# EAGLE schematic atmega2560test (EAGLE 6.1)
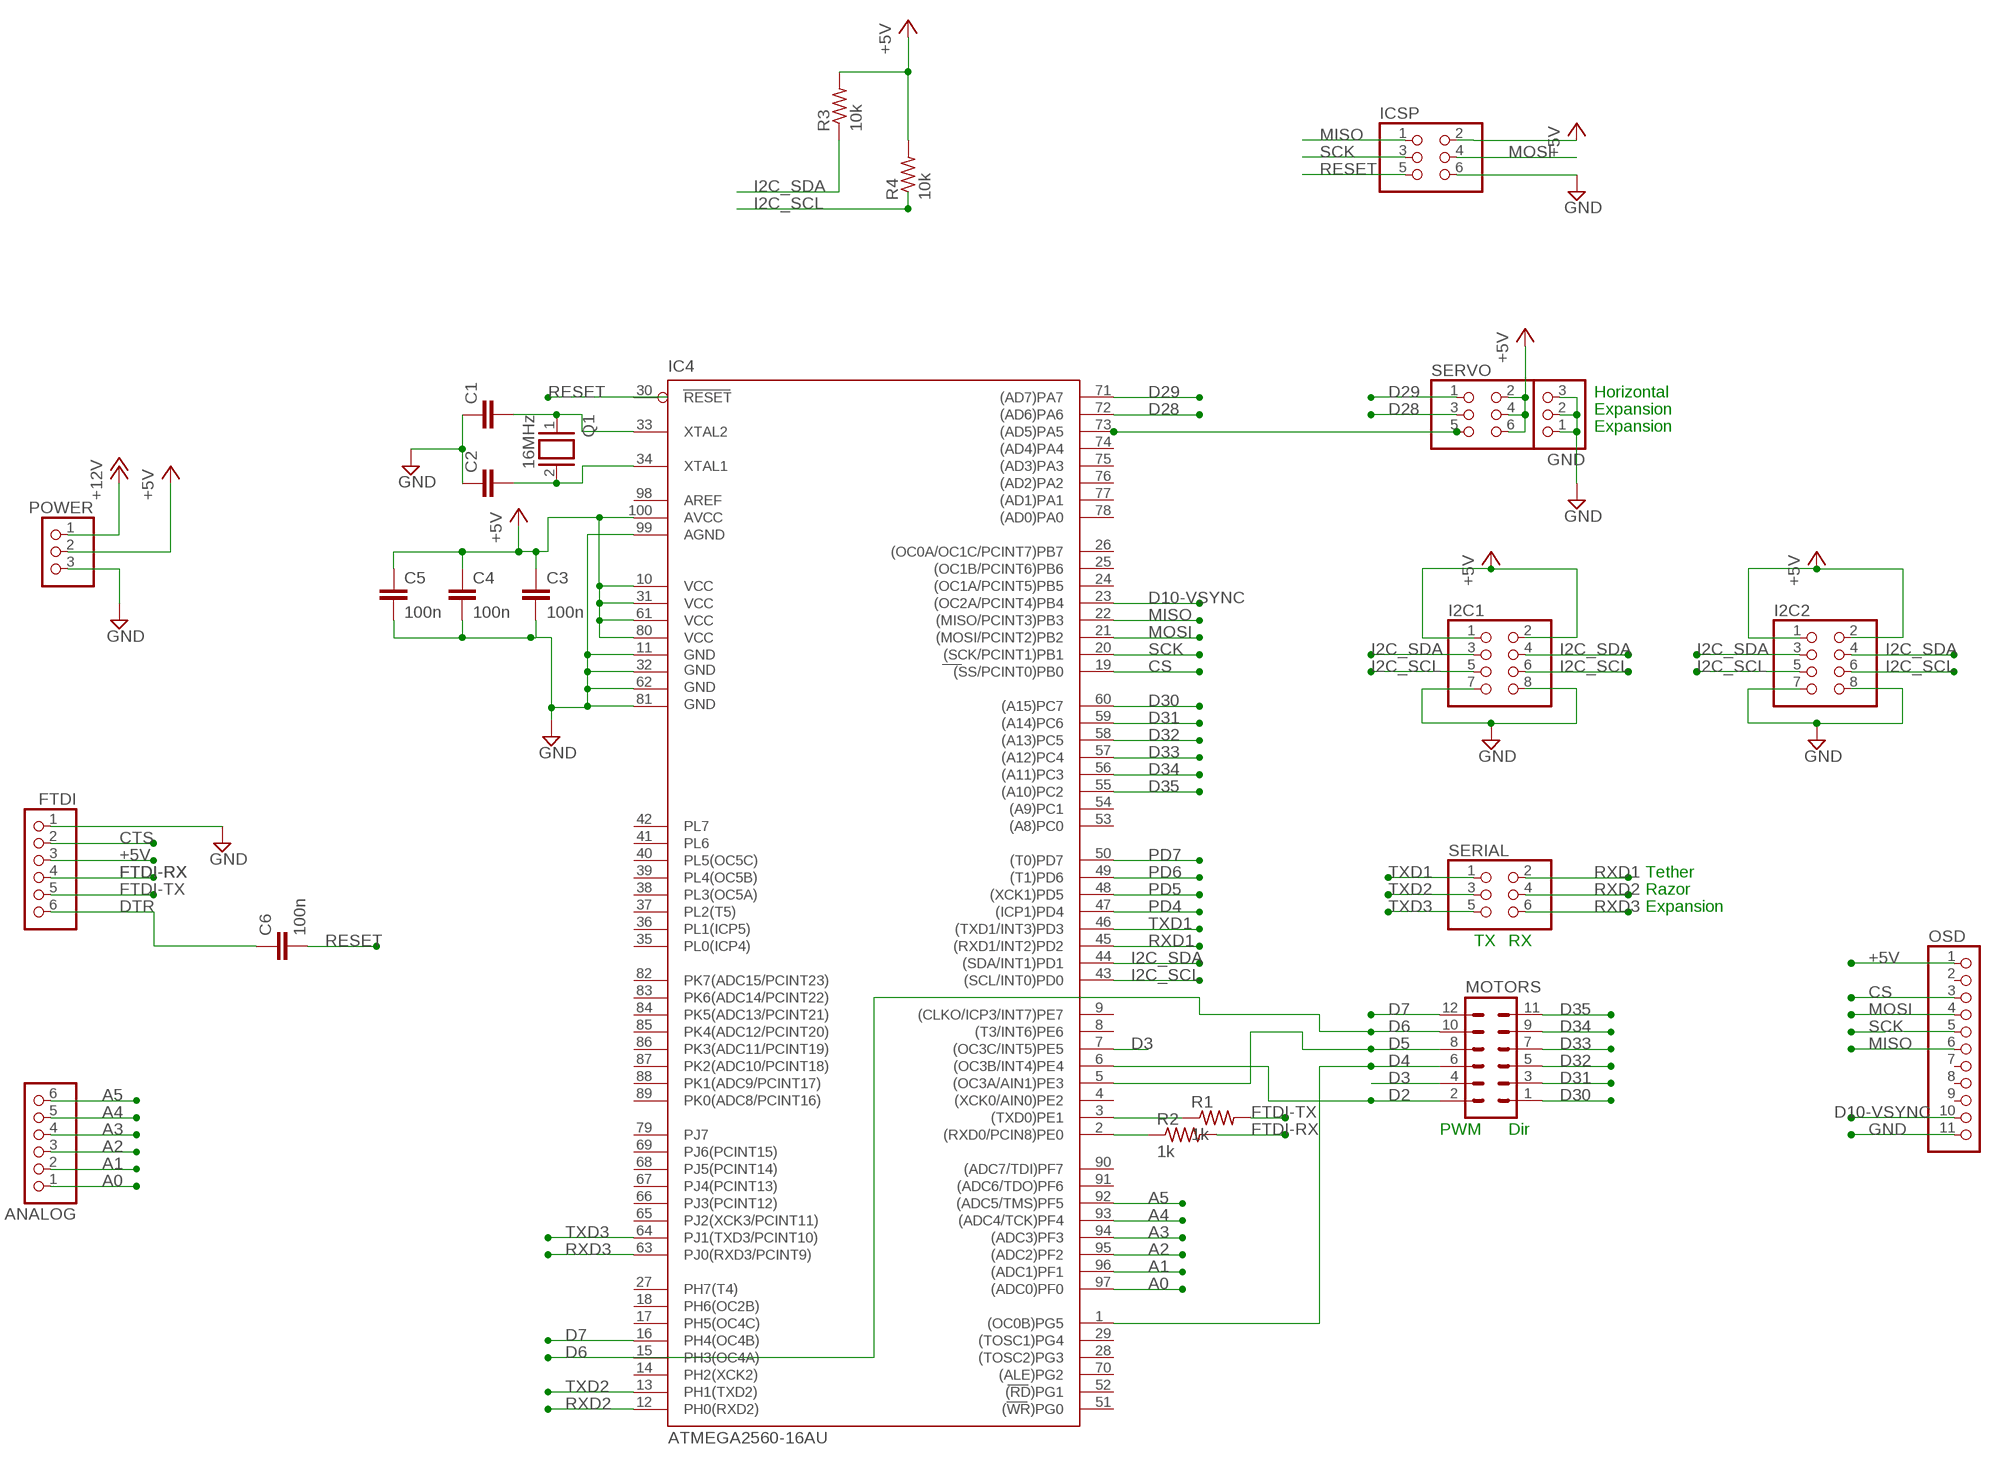
[diagram p0: schematic, sheet 1]

## Parts
ANALOG  PINHD-1X6  [1X06]
C1  C5/3.5  [C5B3.5]
C2  C5/3.5  [C5B3.5]
C3  100n  C5/3.5  [C5B3.5]
C4  100n  C5/3.5  [C5B3.5]
C5  100n  C5/3.5  [C5B3.5]
C6  100n  C-EU050-030X075  [C050-030X075]
FTDI  PINHD-1X6  [1X06]
GND  PINHD-1X3  [1X03]
I2C1  PINHD-2X4  [2X04]
I2C2  PINHD-2X4  [2X04]
IC4  ATMEGA2560-16AU  [TQFP100]
ICSP  PINHD-2X3  [2X03]
MOTORS  MA06-2  [MA06-2]
OSD  PINHD-1X11  [1X11]
POWER  PINHD-1X3  [1X03]
Q1  16MHz  XTAL/S  [QS]
R1  1k  R-US_0207/7  [0207/7]
R2  1k  R-US_0207/7  [0207/7]
R3  10k  R-US_0207/7  [0207/7]
R4  10k  R-US_0207/7  [0207/7]
SERIAL  PINHD-2X3  [2X03]
SERVO  PINHD-2X3  [2X03]

## Nets
+5V: C3.1 C4.1 C5.1 FTDI.3 I2C1.1 I2C1.2 I2C2.1 I2C2.2 IC4.10(VCC) IC4.31(VCC1) IC4.61(VCC2) IC4.80(VCC3) IC4.100(AVCC) ICSP.2 OSD.1 POWER.2 R3.2 R4.2 SERVO.2 SERVO.4 SERVO.6
+12V: POWER.1
A0: ANALOG.1 IC4.97((ADC0)PF0)
A1: ANALOG.2 IC4.96((ADC1)PF1)
A2: ANALOG.3 IC4.95((ADC2)PF2)
A3: ANALOG.4 IC4.94((ADC3)PF3)
A4: ANALOG.5 IC4.93((ADC4/TCK)PF4)
A5: ANALOG.6 IC4.92((ADC5/TMS)PF5)
CS: IC4.19((SS/PCINT0)PB0) OSD.3
CTS: FTDI.2
D2: IC4.6((OC3B/INT4)PE4) MOTORS.2
D3: IC4.7((OC3C/INT5)PE5) MOTORS.4
D4: IC4.1((OC0B)PG5) MOTORS.6
D5: IC4.5((OC3A/AIN1)PE3) MOTORS.8
D6: IC4.15(PH3(OC4A)) MOTORS.10
D7: IC4.16(PH4(OC4B)) MOTORS.12
D10-VSYNC: IC4.23((OC2A/PCINT4)PB4) OSD.10
D28: IC4.72((AD6)PA6) SERVO.3
D29: IC4.71((AD7)PA7) SERVO.1
D30: IC4.60((A15)PC7) MOTORS.1
D31: IC4.59((A14)PC6) MOTORS.3
D32: IC4.58((A13)PC5) MOTORS.5
D33: IC4.57((A12)PC4) MOTORS.7
D34: IC4.56((A11)PC3) MOTORS.9
D35: IC4.55((A10)PC2) MOTORS.11
DTR: C6.1 FTDI.6
FTDI-RX: FTDI.4 R2.2
FTDI-TX: FTDI.5 R1.2
GND: C1.1 C2.1 C3.2 C4.2 C5.2 FTDI.1 GND.1 GND.2 GND.3 I2C1.7 I2C1.8 I2C2.7 I2C2.8 IC4.11(GND) IC4.32(GND1) IC4.62(GND2) IC4.81(GND3) IC4.99(AGND) ICSP.6 OSD.11 POWER.3
I2C_SCL: I2C1.5 I2C1.6 I2C2.5 I2C2.6 IC4.43((SCL/INT0)PD0) R4.1
I2C_SDA: I2C1.3 I2C1.4 I2C2.3 I2C2.4 IC4.44((SDA/INT1)PD1) R3.1
MISO: IC4.22((MISO/PCINT3)PB3) ICSP.1 OSD.6
MOSI: IC4.21((MOSI/PCINT2)PB2) ICSP.4 OSD.4
N$1: C1.2 IC4.33(XTAL2) Q1.1
N$2: C2.2 IC4.34(XTAL1) Q1.2
N$3: IC4.2((RXD0/PCIN8)PE0) R2.1
N$4: IC4.3((TXD0)PE1) R1.1
N$5: IC4.73((AD5)PA5) SERVO.5
PD4: IC4.47((ICP1)PD4)
PD5: IC4.48((XCK1)PD5)
PD6: IC4.49((T1)PD6)
PD7: IC4.50((T0)PD7)
RESET: C6.2 ICSP.5
RXD1: IC4.45((RXD1/INT2)PD2) SERIAL.2
RXD2: IC4.12(PH0(RXD2)) SERIAL.4
RXD3: IC4.63(PJ0(RXD3/PCINT9)) SERIAL.6
SCK: IC4.20((SCK/PCINT1)PB1) ICSP.3 OSD.5
TXD1: IC4.46((TXD1/INT3)PD3) SERIAL.1
TXD2: IC4.13(PH1(TXD2)) SERIAL.3
TXD3: IC4.64(PJ1(TXD3/PCINT10)) SERIAL.5
Unconnected: IC4.4((XCK0/AIN0)PE2) IC4.8((T3/INT6)PE6) IC4.9((CLKO/ICP3/INT7)PE7) IC4.14(PH2(XCK2)) IC4.17(PH5(OC4C)) IC4.18(PH6(OC2B)) IC4.24((OC1A/PCINT5)PB5) IC4.25((OC1B/PCINT6)PB6) IC4.26((OC0A/OC1C/PCINT7)PB7) IC4.27(PH7(T4)) IC4.28((TOSC2)PG3) IC4.29((TOSC1)PG4) IC4.30(RESET) IC4.35(PL0(ICP4)) IC4.36(PL1(ICP5)) IC4.37(PL2(T5)) IC4.38(PL3(OC5A)) IC4.39(PL4(OC5B)) IC4.40(PL5(OC5C)) IC4.41(PL6) IC4.42(PL7) IC4.51((WR)PG0) IC4.52((RD)PG1) IC4.53((A8)PC0) IC4.54((A9)PC1) IC4.65(PJ2(XCK3/PCINT11)) IC4.66(PJ3(PCINT12)) IC4.67(PJ4(PCINT13)) IC4.68(PJ5(PCINT14)) IC4.69(PJ6(PCINT15)) IC4.70((ALE)PG2) IC4.74((AD4)PA4) IC4.75((AD3)PA3) IC4.76((AD2)PA2) IC4.77((AD1)PA1) IC4.78((AD0)PA0) IC4.79(PJ7) IC4.82(PK7(ADC15/PCINT23)) IC4.83(PK6(ADC14/PCINT22)) IC4.84(PK5(ADC13/PCINT21)) IC4.85(PK4(ADC12/PCINT20)) IC4.86(PK3(ADC11/PCINT19)) IC4.87(PK2(ADC10/PCINT18)) IC4.88(PK1(ADC9/PCINT17)) IC4.89(PK0(ADC8/PCINT16)) IC4.90((ADC7/TDI)PF7) IC4.91((ADC6/TDO)PF6) IC4.98(AREF) OSD.2 OSD.7 OSD.8 OSD.9

## Notes on the sheet
- Horizontal
- Expansion
- Expansion
- Tether
- Razor
- Expansion
- TX | RX
- PWM | Dir

## Library data of the parts
ANALOG FTDI = pinhead:PINHD-1X6: PIN HEADER
C1-C5 = capacitor-wima:C: CAPACITOR naming: grid - package width
C6 = rcl:C-EU: CAPACITOR, European symbol
GND POWER = pinhead:PINHD-1X3: PIN HEADER
I2C1 I2C2 = pinhead:PINHD-2X4: PIN HEADER
IC4 = atmel-2005:ATMEGA*: MICROCONTROLLER 64/128/256 Kbytes FLASH 4 Kbytes EEPROM 8 Kbytes SRAM 86 General Purpose I/O pins 12-channels16-bit PWM 4 x Serial USARTs 16-channels 10-bit A/D
ICSP SERIAL SERVO = pinhead:PINHD-2X3: PIN HEADER
MOTORS = con-lstb:MA06-2: PIN HEADER; OC_FARNELL: unknown; OC_NEWARK: unknown
OSD = pinhead:PINHD-1X11: PIN HEADER
Q1 = special:XTAL/S: CRYSTAL
R1-R4 = resistor:R-US_: RESISTOR, American symbol